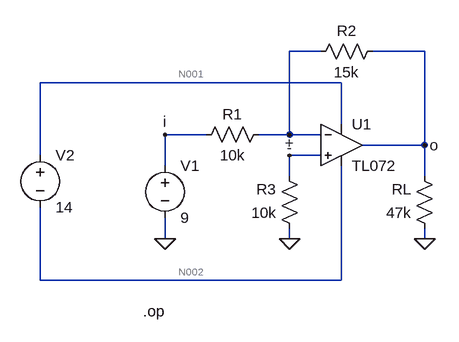
[diagram p0: schematic Draft1.asc]
Draft1.asc, the LTspice schematic file:
Version 4
SHEET 1 880 680
WIRE 208 -48 160 -48
WIRE 368 -48 288 -48
WIRE 240 0 -224 0
WIRE 240 64 240 0
WIRE 32 80 -32 80
WIRE 160 80 160 -48
WIRE 160 80 112 80
WIRE 208 80 160 80
WIRE 368 96 368 -48
WIRE 368 96 272 96
WIRE -224 112 -224 0
WIRE 208 112 160 112
WIRE -32 128 -32 80
WIRE 160 144 160 112
WIRE 368 144 368 96
WIRE -32 240 -32 208
WIRE 160 240 160 224
WIRE 368 240 368 224
WIRE -224 304 -224 192
WIRE 240 304 240 128
WIRE 240 304 -224 304
FLAG -32 240 0
FLAG 160 240 0
FLAG 368 240 0
FLAG -32 80 i
FLAG 368 96 o
FLAG 160 112 +
FLAG 160 80 -
SYMBOL OpAmps\\TL072 240 32 R0
SYMATTR InstName U1
SYMBOL res 128 64 R90
WINDOW 0 0 56 VBottom 2
WINDOW 3 32 56 VTop 2
SYMATTR InstName R1
SYMATTR Value 10k
SYMBOL res 304 -64 R90
WINDOW 0 0 56 VBottom 2
WINDOW 3 32 56 VTop 2
SYMATTR InstName R2
SYMATTR Value 15k
SYMATTR SpiceLine tol=20
SYMBOL res 176 240 R180
WINDOW 0 36 76 Left 2
WINDOW 3 36 40 Left 2
SYMATTR InstName R3
SYMATTR Value 10k
SYMATTR SpiceLine tol=20
SYMBOL res 384 240 R180
WINDOW 0 36 76 Left 2
WINDOW 3 36 40 Left 2
SYMATTR InstName RL
SYMATTR Value 47k
SYMATTR SpiceLine tol=20
SYMBOL voltage -32 112 R0
WINDOW 123 0 0 Left 0
WINDOW 39 0 0 Left 0
SYMATTR InstName V1
SYMATTR Value 9
SYMBOL voltage -224 96 R0
WINDOW 123 0 0 Left 0
WINDOW 39 0 0 Left 0
SYMATTR InstName V2
SYMATTR Value 14
TEXT -66 352 Left 2 !.op

The netlist it stands for:
* Draft1.asc
XU1 + - N001 N002 o TL072  ; pins In+ In- V+ V- OUT
R1 - i 10k
R2 o - 15k tol=20
R3 0 + 10k tol=20
RL 0 o 47k tol=20
V1 i 0 9
V2 N001 N002 14
.op
.backanno
.end

* Results of the author's LTspice run, read from the files saved beside the schematic
* Operating Point:
*   V(o) = -13.66 V
*   V(n002) = -26.07 V
*   V(n001) = -12.07 V
*   V(-) = -62.9 mV
*   V(+) = -562.6 nV
*   V(i) = 9 V
*   I(Rl) = 290.6 µA
*   I(R3) = 56.26 pA
*   I(R2) = -906.3 µA
*   I(R1) = -906.3 µA
*   I(V2) = -6.71 mA
*   I(V1) = -906.3 µA
*   Ix(u1:1) = 56.26 pA
*   Ix(u1:2) = 56.06 pA
*   Ix(u1:3) = 6.71 mA
*   Ix(u1:4) = -6.71 mA
*   Ix(u1:5) = 1.197 mA